# EAGLE design Mergen Ground Station_V2.0 (EAGLE 9.6.2)

## Sheet 1 of 5
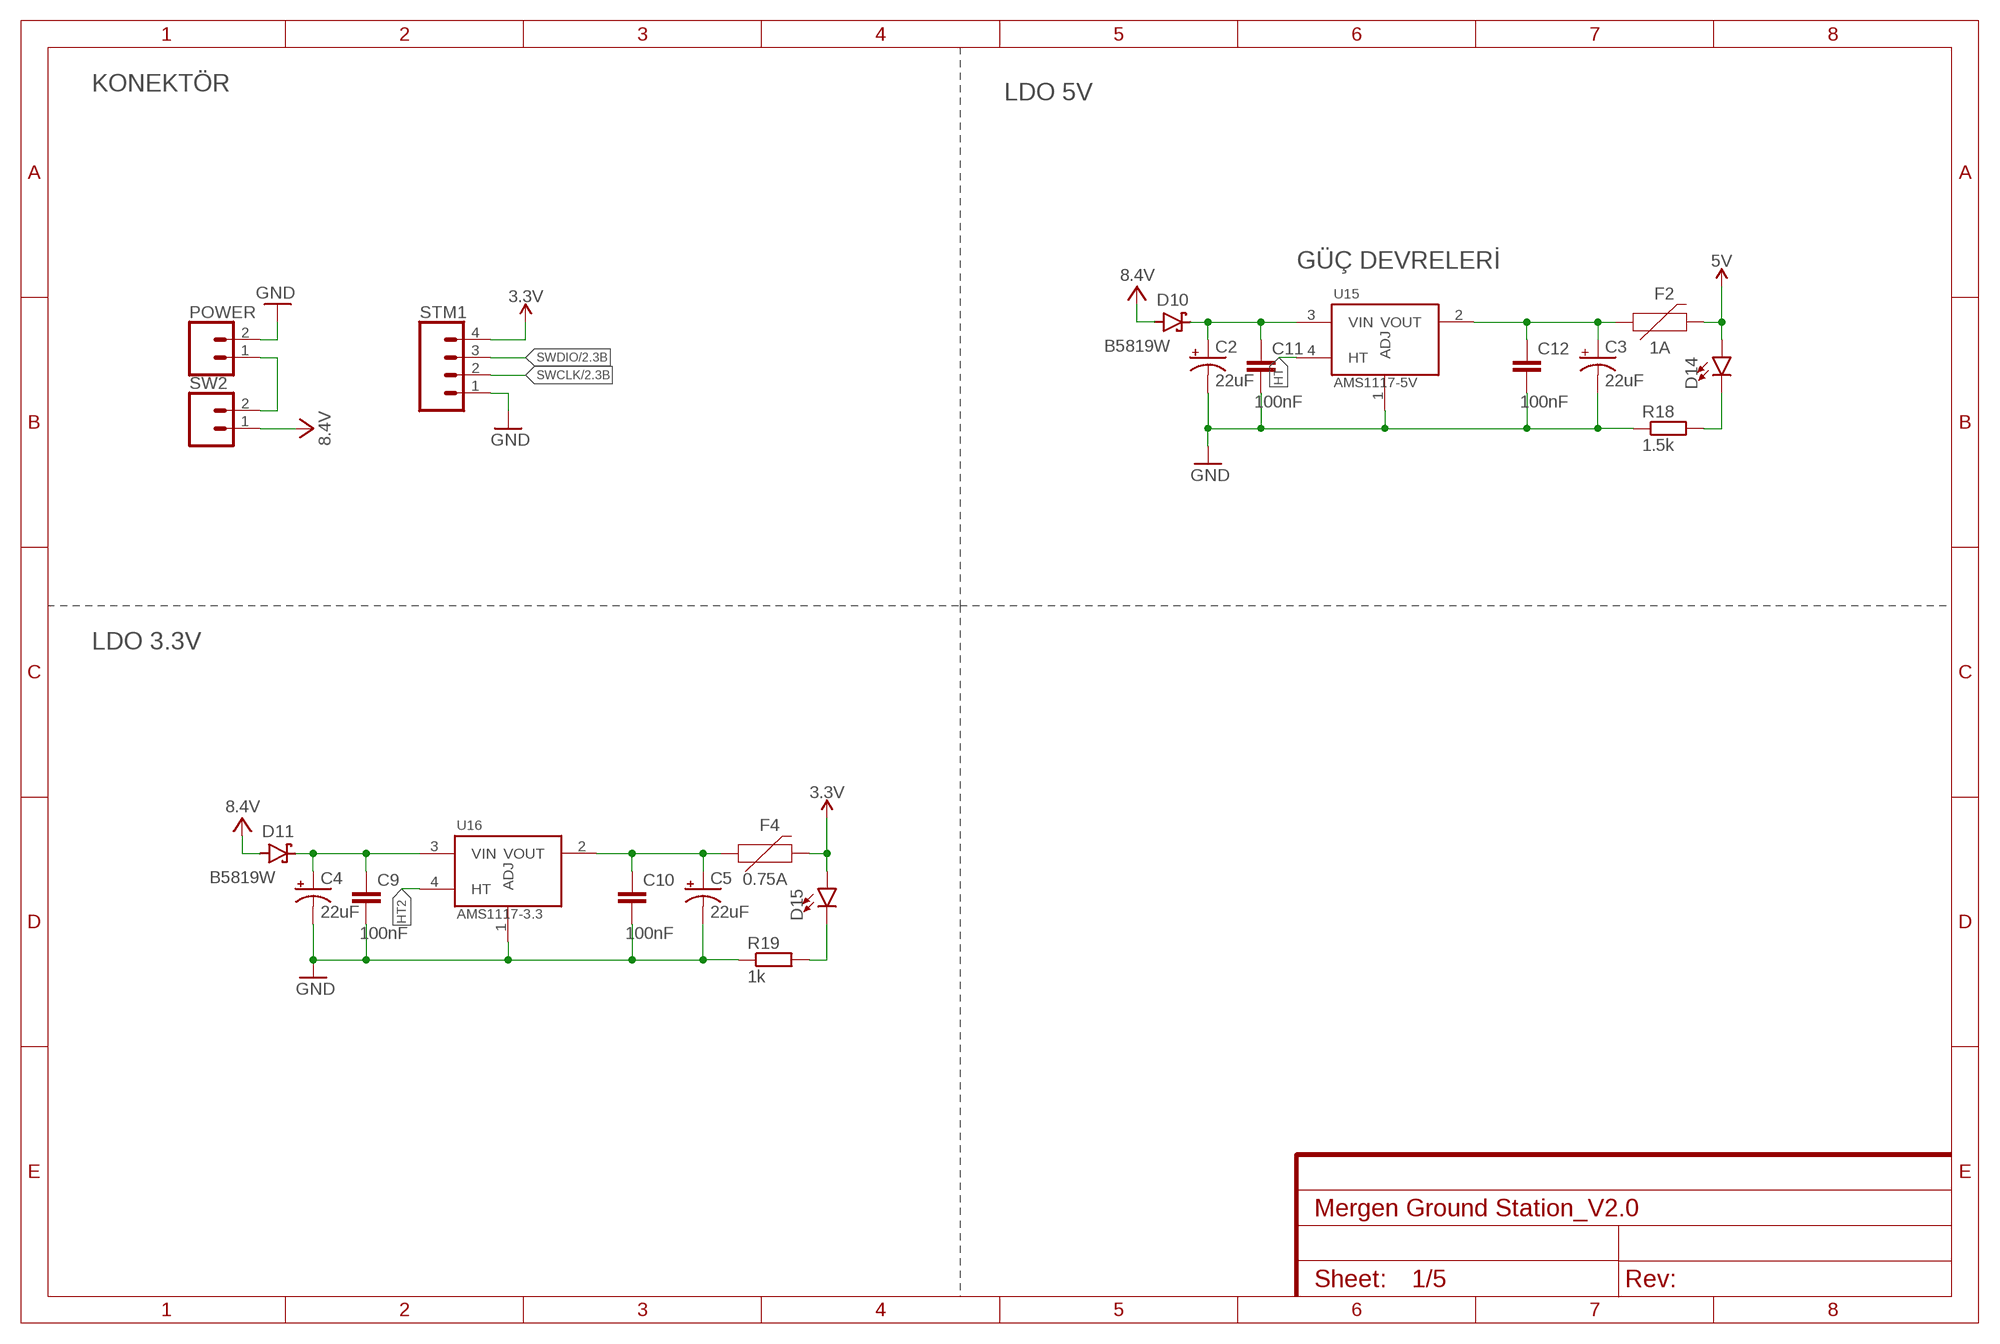
[diagram p0: schematic, sheet 1]

### Parts
C2  22uF  CPOL-USCT3528  [CT3528]
C3  22uF  CPOL-USCT3528  [CT3528]
C4  22uF  CPOL-USCT3528  [CT3528]
C5  22uF  CPOL-USCT3528  [CT3528]
C9  100nF  C-EUC0603  [C0603]
C10  100nF  C-EUC0603  [C0603]
C11  100nF  C-EUC0603  [C0603]
C12  100nF  C-EUC0603  [C0603]
D10  B5819W  SCHOTTKY_MBR0520LT1GDO-219  [SODFL3718X115]
D11  B5819W  SCHOTTKY_MBR0520LT1GDO-219  [SODFL3718X115]
D14  LED0603  [LED-0603]
D15  LED0603  [LED-0603]
F2  1A  PPTC_HALF-AMP  [1206]
F4  0.75A  PPTC_HALF-AMP  [1206]
POWER  CONN_023.5MM-NO_SILK  [SCREWTERMINAL-3.5MM-2-NS]
R18  1.5k  R-EU_R0603  [R0603]
R19  1k  R-EU_R0603  [R0603]
STM1  CONN_04  [1X04]
SW2  CONN_023.5MM-NO_SILK  [SCREWTERMINAL-3.5MM-2-NS]
U15  AMS1117-5V  AMS1117-3.3  [SOT229P700X180-4N]
U16  AMS1117-3.3  [SOT229P700X180-4N]

### Nets
3.3V: D15.A F4.2 STM1.4 ; also sheet 2,3,5
5V: D14.A F2.2 ; also sheet 4,5
GND: C2.- C3.- C4.- C5.- C9.2 C10.2 C11.2 C12.2 POWER.2 R18.1 R19.1 STM1.1 U15.1(ADJ) U16.1(ADJ) ; also sheet 2,3,4,5
HT: U15.4(HT)
HT2: U16.4(HT)
N$22: C2.+ C11.1 D10.1(C) U15.3(VIN)
N$23: C3.+ C12.1 F2.1 U15.2(VOUT)
N$24: C4.+ C9.1 D11.1(C) U16.3(VIN)
N$25: C5.+ C10.1 F4.1 U16.2(VOUT)
N$30: POWER.1 SW2.2
N$35: D14.C R18.2
N$36: D15.C R19.2
SWCLK: STM1.2 ; also sheet 2
SWDIO: STM1.3 ; also sheet 2
VCC: D10.2(A) D11.2(A) SW2.1 ; supply symbol labelled 8.4V ; also sheet 2

### Notes on the sheet
- KONEKTÖR
- LDO 5V
- GÜÇ DEVRELERİ
- LDO 3.3V

## Sheet 2 of 5
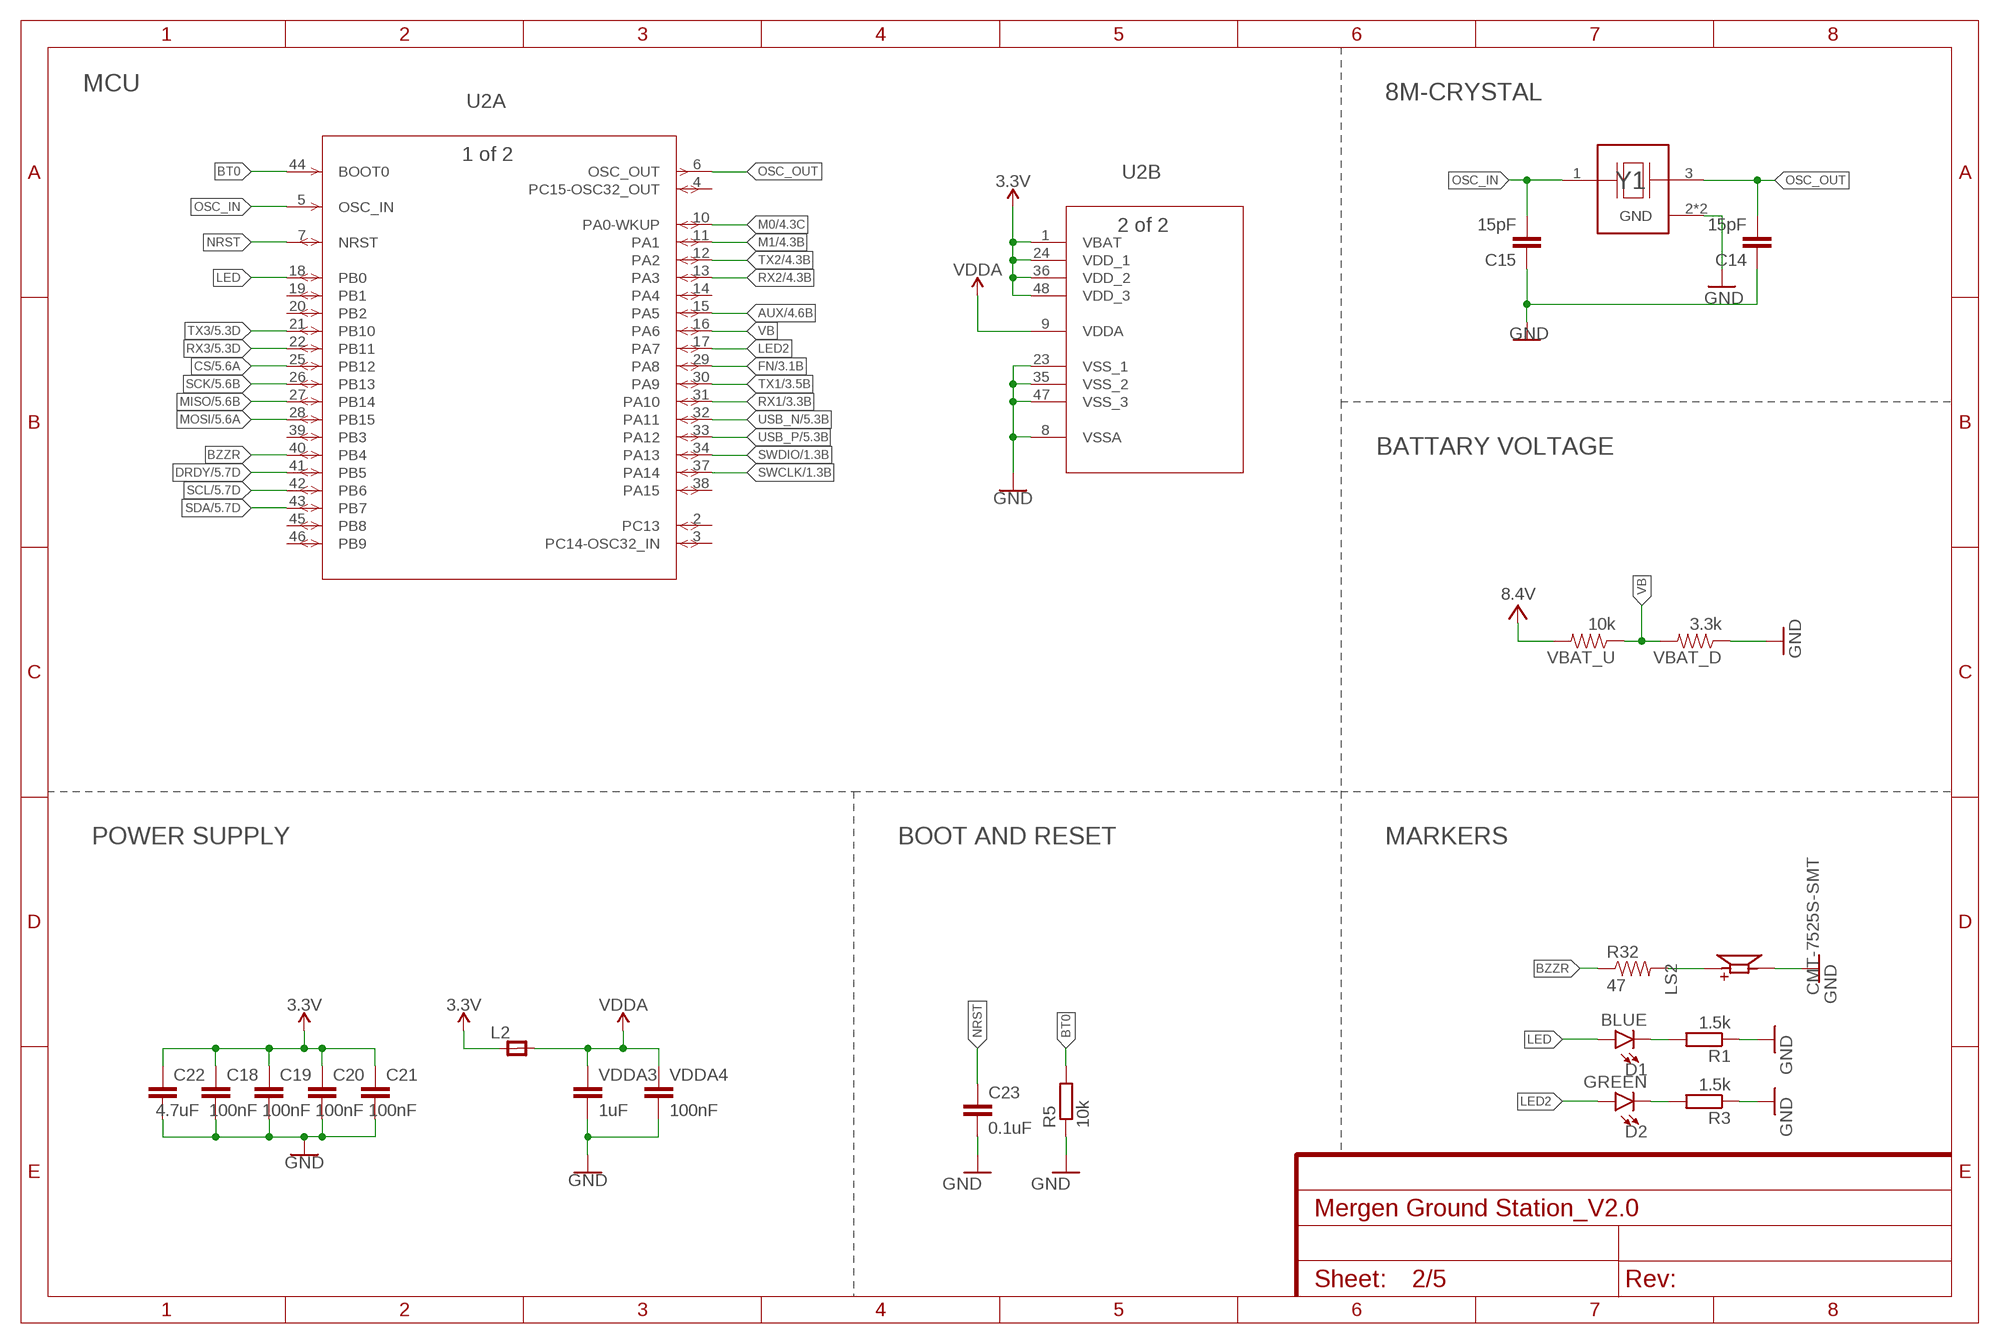
[diagram p1: schematic, sheet 2]

### Parts
C14  15pF  C-EUC0603  [C0603]
C15  15pF  C-EUC0603  [C0603]
C18  100nF  C-EUC0603  [C0603]
C19  100nF  C-EUC0603  [C0603]
C20  100nF  C-EUC0603  [C0603]
C21  100nF  C-EUC0603  [C0603]
C22  4.7uF  C-EUC0603  [C0603]
C23  0.1uF  C-EUC0603  [C0603]
D1  BLUE  LED0603  [LED-0603]
D2  GREEN  LED0603  [LED-0603]
L2  RC-MASTER-SMD_FB_0805MP  [RC-MASTER-SMD_L0805MP]
LS2  CMT-7525S-SMT  [CUI_CMT-7525S-SMT]
R1  1.5k  R-EU_R0603  [R0603]
R3  1.5k  R-EU_R0603  [R0603]
R5  10k  R-EU_R0603  [R0603]
R32  47  0OHM-0603-1/10W-5%  [0603]
U2  STM32F103C8T6  [LQFP48-7X7MM]
VBAT_D  3.3k  2.0KOHM1/10W5%(0603)  [0603-RES]
VBAT_U  10k  2.0KOHM1/10W5%(0603)  [0603-RES]
VDDA3  1uF  0.1UF-0603-25V-(+80/-20%)  [0603]
VDDA4  100nF  0.1UF-0603-25V-(+80/-20%)  [0603]
Y1  ABMM2-8.000MHZ-E2-T  [XTAL_ABMM2-8.000MHZ-E2-T]

### Nets
3.3V: C18.1 C19.1 C20.1 C21.1 C22.1 L2.1 U2.1(B:VBAT) U2.24(B:VDD_1) U2.36(B:VDD_2) U2.48(B:VDD_3) ; also sheet 1,3,5
AUX: U2.15(A:PA5) ; also sheet 4
BT0: R5.2 U2.44(A:BOOT0)
BZZR: R32.1 U2.40(A:PB4)
CS: U2.25(A:PB12) ; also sheet 5
DRDY: U2.41(A:PB5) ; also sheet 5
FN: U2.29(A:PA8) ; also sheet 3
GND: C14.1 C15.1 C18.2 C19.2 C20.2 C21.2 C22.2 C23.2 LS2.N R1.1 R3.1 R5.1 U2.8(B:VSSA) U2.23(B:VSS_1) U2.35(B:VSS_2) U2.47(B:VSS_3) VBAT_D.1 VDDA3.2 VDDA4.2 Y1.2(GND) Y1.4(GND) ; also sheet 1,3,4,5
LED: D1.A U2.18(A:PB0)
LED2: D2.A U2.17(A:PA7)
M0: U2.10(A:PA0-WKUP) ; also sheet 4
M1: U2.11(A:PA1) ; also sheet 4
MISO: U2.27(A:PB14) ; also sheet 5
MOSI: U2.28(A:PB15) ; also sheet 5
N$1: D1.C R1.2
N$3: D2.C R3.2
N$4: LS2.P R32.2
NRST: C23.1 U2.7(A:NRST)
OSC_IN: C15.2 U2.5(A:OSC_IN) Y1.1
OSC_OUT: C14.2 U2.6(A:OSC_OUT) Y1.3
RX1: U2.31(A:PA10) ; also sheet 3
RX2: U2.13(A:PA3) ; also sheet 4
RX3: U2.22(A:PB11) ; also sheet 5
SCK: U2.26(A:PB13) ; also sheet 5
SCL: U2.42(A:PB6) ; also sheet 5
SDA: U2.43(A:PB7) ; also sheet 5
SWCLK: U2.37(A:PA14) ; also sheet 1
SWDIO: U2.34(A:PA13) ; also sheet 1
TX1: U2.30(A:PA9) ; also sheet 3
TX2: U2.12(A:PA2) ; also sheet 4
TX3: U2.21(A:PB10) ; also sheet 5
USB_N: U2.32(A:PA11) ; also sheet 5
USB_P: U2.33(A:PA12) ; also sheet 5
VB: U2.16(A:PA6) VBAT_D.2 VBAT_U.1
VCC: VBAT_U.2 ; supply symbol labelled 8.4V ; also sheet 1
VDDA: L2.2 U2.9(B:VDDA) VDDA3.1 VDDA4.1
Unconnected: U2.2(A:PC13) U2.3(A:PC14-OSC32_IN) U2.4(A:PC15-OSC32_OUT) U2.14(A:PA4) U2.19(A:PB1) U2.20(A:PB2) U2.38(A:PA15) U2.39(A:PB3) U2.45(A:PB8) U2.46(A:PB9)

### Notes on the sheet
- MCU
- 8M-CRYSTAL
- BATTARY VOLTAGE
- POWER SUPPLY | BOOT AND RESET | MARKERS

## Sheet 3 of 5
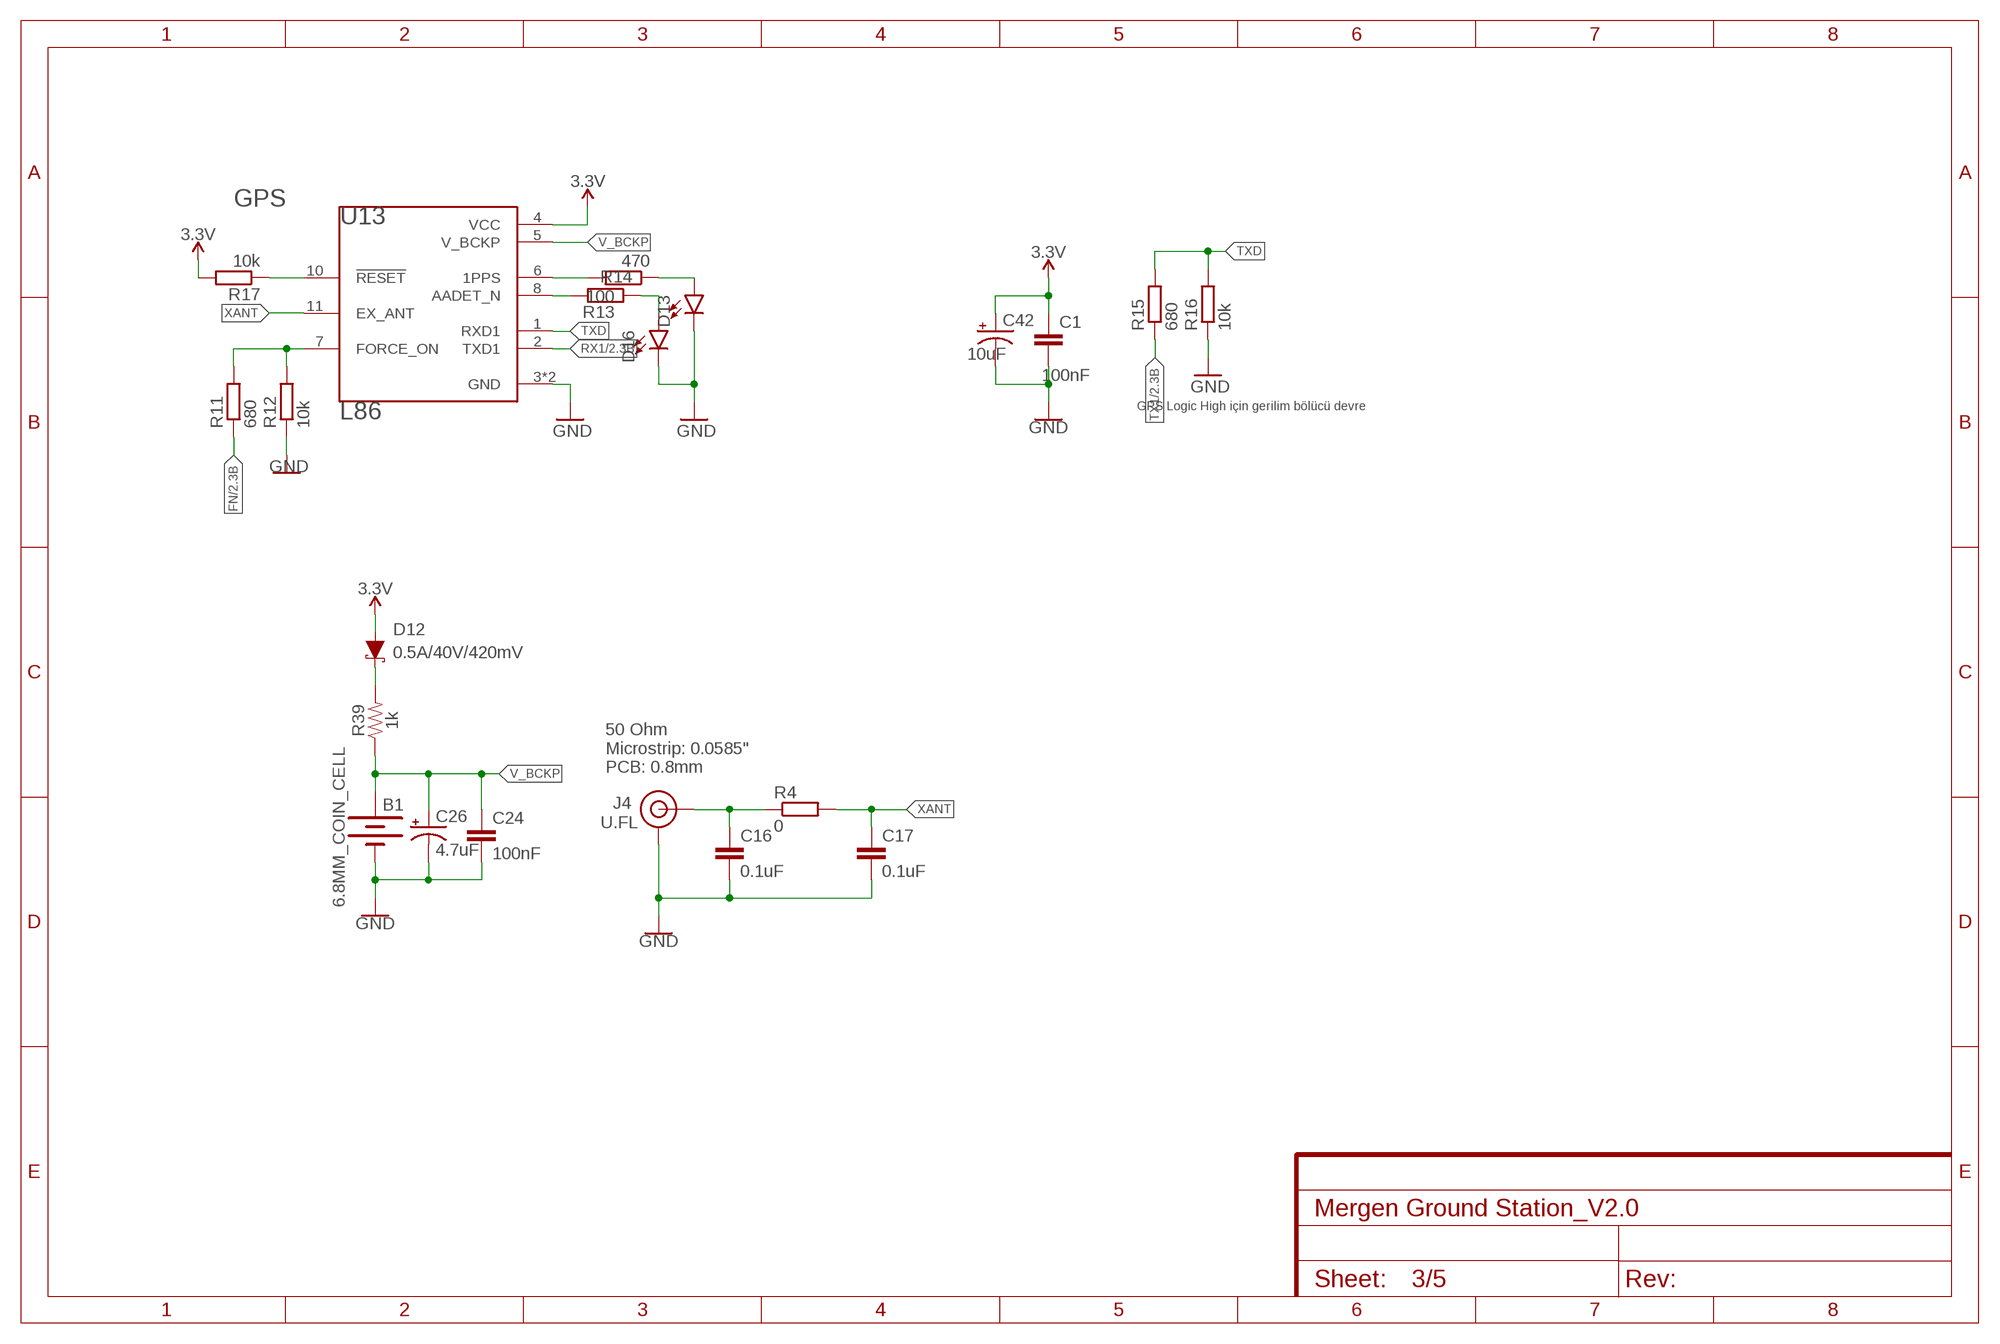
[diagram p2: schematic, sheet 3]

### Parts
B1  6.8MM_COIN_CELL  BATTERY-6.8MM_SMD  [BATTCON-6.8MM]
C1  100nF  C-EUC0603  [C0603]
C16  0.1uF  C-EUC0603  [C0603]
C17  0.1uF  C-EUC0603  [C0603]
C24  100nF  C-EUC0603  [C0603]
C26  4.7uF  CPOL-USA/3216-18R  [A/3216-18R]
C42  10uF  10UF-POLAR-EIA3216-16V-10%(TANT)  [EIA3216]
D12  0.5A/40V/420mV  DIODE-SCHOTTKY-PMEG4005EJ  [SOD-323]
D13  LED0603  [LED-0603]
D16  LED0603  [LED-0603]
J4  U.FL  U.FL2PIN  [U.FL]
R4  0  R-EU_R0603  [R0603]
R11  680  R-EU_R0603  [R0603]
R12  10k  R-EU_R0603  [R0603]
R13  100  R-EU_R0603  [R0603]
R14  470  R-EU_R0603  [R0603]
R15  680  R-EU_R0603  [R0603]
R16  10k  R-EU_R0603  [R0603]
R17  10k  R-EU_R0603  [R0603]
R39  1k  1KOHM-0603-1/10W-1%  [0603]
U13  L86  [XCVR_L86]

### Nets
3.3V: C1.1 C42.+ D12.A R17.2 U13.4(VCC) ; also sheet 1,2,5
FN: R11.1 ; also sheet 2
GND: B1.- C1.2 C16.2 C17.2 C24.2 C26.- C42.- D13.C D16.C J4.1(GND) J4.2(GND) R12.1 R16.1 U13.3(GND) U13.12(GND) ; also sheet 1,2,4,5
N$2: D16.A R13.1
N$31: D12.C R39.2
N$32: R17.1 U13.10(!RESET)
N$33: R14.2 U13.6(1PPS)
N$34: D13.A R14.1
N$37: R13.2 U13.8(AADET_N)
N$39: C16.1 J4.FEED(SIGNAL) R4.1
N$40: R11.2 R12.2 U13.7(FORCE_ON)
RX1: U13.2(TXD1) ; also sheet 2
TX1: R15.1 ; also sheet 2
TXD: R15.2 R16.2 U13.1(RXD1)
V_BCKP: B1.+ C24.1 C26.+ R39.1 U13.5(V_BCKP)
XANT: C17.1 R4.2 U13.11(EX_ANT)

### Notes on the sheet
- GPS
- GPS Logic High için gerilim bölücü devre
- 50 Ohm 
  Microstrip: 0.0585"
  PCB: 0.8mm

## Sheet 4 of 5
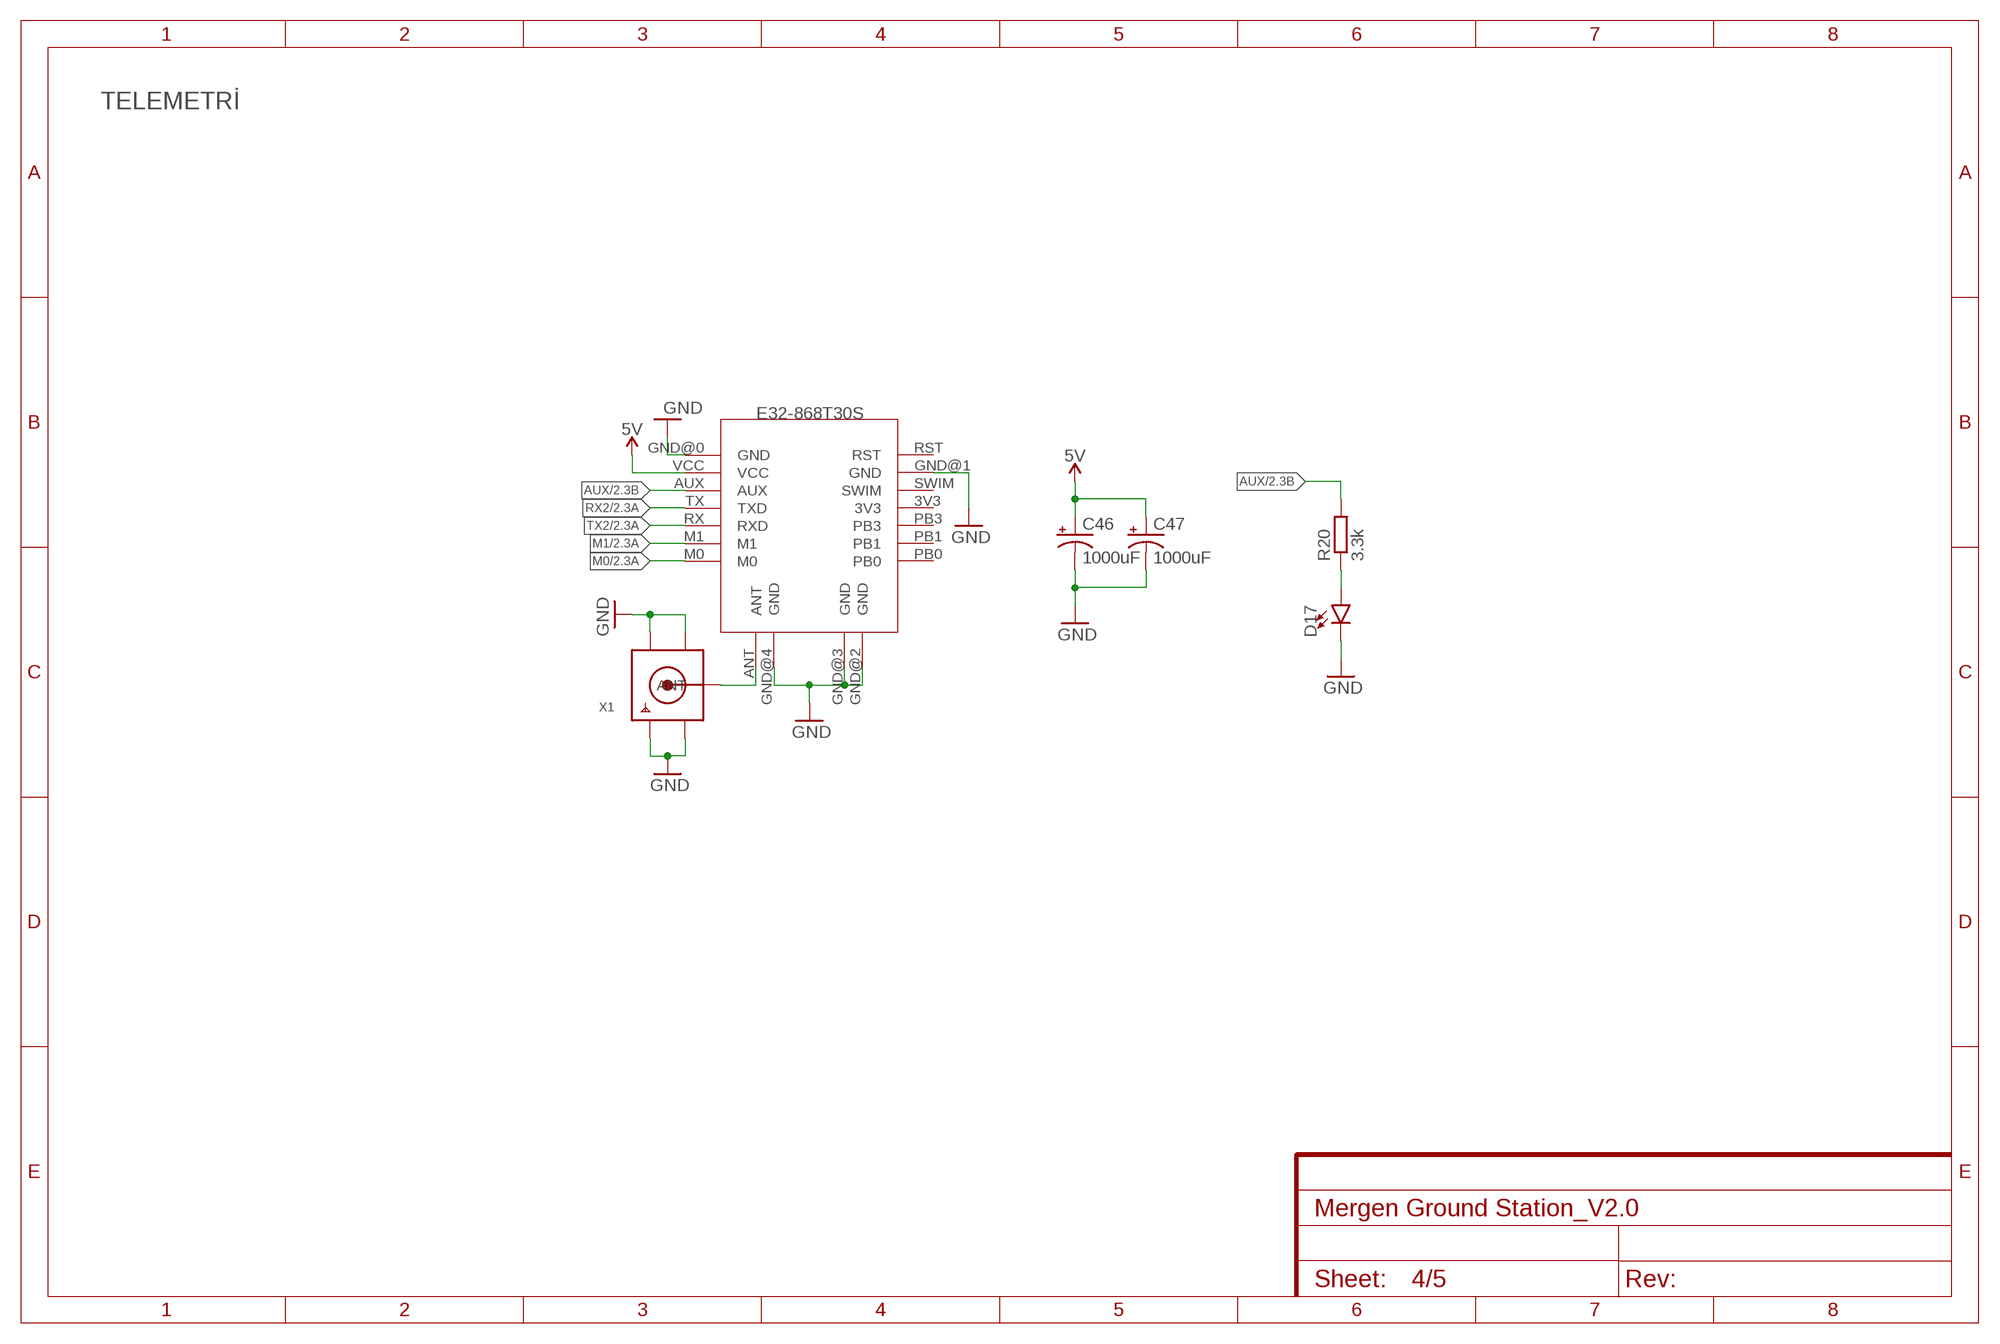
[diagram p3: schematic, sheet 4]

### Parts
C46  1000uF  CPOL-US150CLZ-1010  [150CLZ-1010]
C47  1000uF  CPOL-US150CLZ-1010  [150CLZ-1010]
D17  LED0603  [LED-0603]
R20  3.3k  R-EU_R0603  [R0603]
U14  E32-868T30S  [E32-868T30S]
X1  SMACONNECTOR  [SMA90_DIP]

### Nets
5V: C46.+ C47.+ U14.VCC ; also sheet 1,5
AUX: R20.2 U14.AUX ; also sheet 2
GND: C46.- C47.- D17.C U14.GND@0(GND) U14.GND@1(GND) U14.GND@2(GND) U14.GND@3(GND) U14.GND@4(GND) X1.GND1 X1.GND2 X1.GND3 X1.GND4 ; also sheet 1,2,3,5
M0: U14.M0 ; also sheet 2
M1: U14.M1 ; also sheet 2
N$27: U14.ANT X1.ANTENNA(ANT)
N$41: D17.A R20.1
RX2: U14.TX(TXD) ; also sheet 2
TX2: U14.RX(RXD) ; also sheet 2
Unconnected: U14.3V3 U14.PB0 U14.PB1 U14.PB3 U14.RST U14.SWIM

### Notes on the sheet
- TELEMETRİ

## Sheet 5 of 5
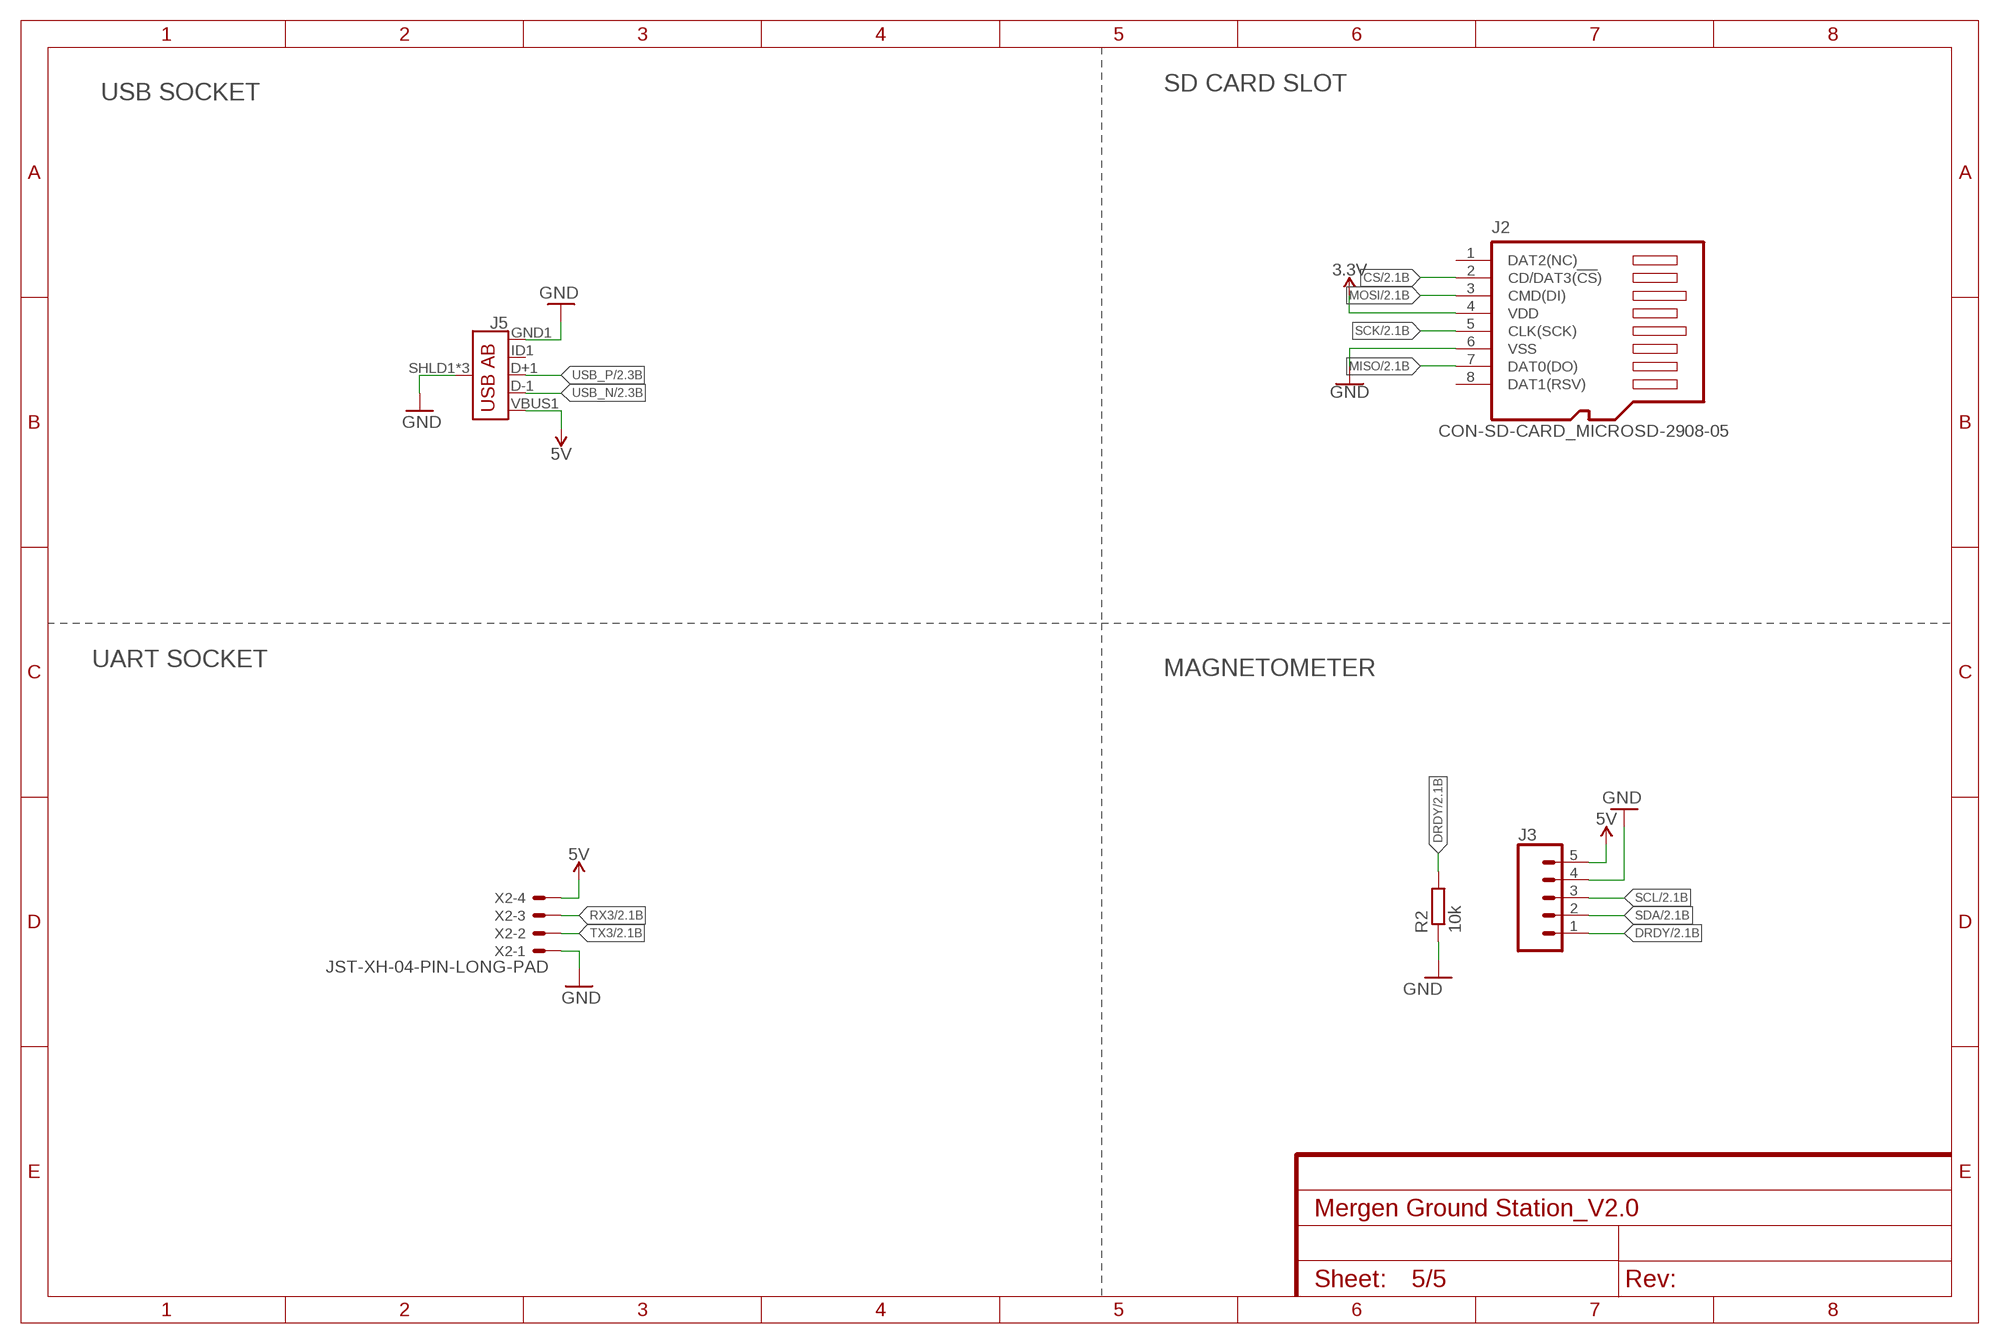
[diagram p4: schematic, sheet 5]

### Parts
J2  CON-SD-CARD_MICROSD-2908-05  [CON-SD-CARD_2908-05]
J3  CONN_05LOCK_LONGPADS  [1X05_LOCK_LONGPADS]
J5  USB_AB_SMT  [USB-AB-MICRO-SMD]
R2  10k  R-EU_R0603  [R0603]
X2  JST-XH-04-PIN-LONG-PAD  [JST-XH-04-PACKAGE-LONG-PAD]

### Nets
3.3V: J2.4(VDD) ; also sheet 1,2,3
5V: J3.5 J5.VBUS1(VBUS) X2.4 ; also sheet 1,4
CS: J2.2(CD/DAT3(!CS!)) ; also sheet 2
DRDY: J3.1 R2.2 ; also sheet 2
GND: J2.6(VSS) J3.4 J5.GND1(GND) J5.SHLD1(SHIELD) J5.SHLD2(SHIELD) J5.SHLD3(SHIELD) R2.1 X2.1 ; also sheet 1,2,3,4
MISO: J2.7(DAT0(DO)) ; also sheet 2
MOSI: J2.3(CMD(DI)) ; also sheet 2
RX3: X2.3 ; also sheet 2
SCK: J2.5(CLK(SCK)) ; also sheet 2
SCL: J3.3 ; also sheet 2
SDA: J3.2 ; also sheet 2
TX3: X2.2 ; also sheet 2
USB_N: J5.D-1(D-) ; also sheet 2
USB_P: J5.D+1(D+) ; also sheet 2
Unconnected: J2.1(DAT2(NC)) J2.8(DAT1(RSV)) J2.GND@1(GND) J2.GND@2(GND) J2.GND@3(GND) J2.GND@4(GND) J5.ID1(USBID)

### Notes on the sheet
- SD CARD SLOT
- USB SOCKET
- UART SOCKET
- MAGNETOMETER

## Library data of the parts
B1 = SparkFun-Batteries:BATTERY: Battery - Single Cell A variety of battery chemistries, sizes, and footprints. Device List: 20MM_PTH - Coin Cell Battery Holder - 20mm (PTH) <https://www.sparkfun.com/products/783> 6.8MM_PTH - Coin Cell Battery Holder - 6.8MM(SMD) <https://www.digikey.com/product-detail/en/seiko-instruments/MS621FE-FL11E/728-1057-ND/1889208?WT.srch=1&gclid=CNOQ5a6LzdQCFZS2wAodXCkE0g> 12MM_SMD - Coin Cell Battery Holder - 12mm (SMD) <https://www.sparkfun.com/products/10592> 12MM_PTH - Coin Cell Battery Holder - 12mm (PTH) <https://www.sparkfun.com/products/7948> 20MM_SMD - 20mm Coin Cell Battery Holder (SMD) (2 legs) Used on the Big Time Watch Kit <https://www.sparkfun.com/products/11734> 20MM_SMD_4LEGS - Coin Cell Battery Holder - 20mm (SMD) <https://www.sparkfun.com/products/11892> 20MM_SMD_4LEGS_OVERPASTE - Coin Cell Battery Holder - 20mm (SMD) <https://www.sparkfun.com/products/11892> (Over-paste on the legs) 24.5MM_PTH - Coin Cell Battery Holder - 24.5mm (PTH) <https://www.sparkfun.com/products/8863> 9V - 9V Battery Holder - PC Mount Used on the SparkFun SparkPunk Sound Kit <https://www.sparkfun.com/products/11177> and SparkFun SparkPunk Sequencer Kit <https://www.sparkfun.com/products/12707> 18650 - Battery Holder - 18650 (PTH) <https://www.sparkfun.com/products/13113> AA - Battery Holder - 1xAA (PTH) <https://www.sparkfun.com/products/7949> AAA - Battery Holder - 1xAAA (PTH) <https://www.sparkfun.com/products/12718> AA_KIT - Battery Holder - 1xAA (PTH) <https://www.sparkfun.com/products/7949> Special kit package - pads only have exposed copper on one side of the board. AAA_KIT - Battery Holder - 1xAAA (PTH) <https://www.sparkfun.com/products/12718> Special kit package - pads only have exposed copper on one side of the board.; PROD_ID: BATT-13734
C1 C9-C12 C14-C24 = rcl:C-EU: CAPACITOR, European symbol; SPICEPREFIX: C
C2-C5 C26 = rcl:CPOL-US: POLARIZED CAPACITOR, American symbol; SPICEPREFIX: C
C42 = SparkFun-Capacitors:10UF-POLAR: 10.0µF polarized capacitors A capacitor is a passive two-terminal electrical component used to store electrical energy temporarily in an electric field.; PROD_ID: CAP-00811
C46 C47 = adafruit:CPOL-US: POLARIZED CAPACITOR, American symbol
D1 D2 D13-D17 = SparkFun-LED:LED: LED (Generic) Standard schematic elements and footprints for 5mm, 3mm, 1206, and 0603 sized LEDs. Generic LEDs with no color specified.
D10 D11 = Diode:SCHOTTKY_: Schottky Diode - Popular parts; CATEGORY: Diode; DESCRIPTION: DIODE SCHOTTKY 20V 500MA SOD123; MANUFACTURER: ON Semiconductor; MPN: MBR0520LT1G; SUB-CATEGORY: Schottky; VALUE: MBR0520LT1G
D12 = SparkFun-DiscreteSemi:DIODE-SCHOTTKY: Schottky diode A Schottky diode is a semiconductor diode which has a low forward voltage drop and a very fast switching action.; PROD_ID: DIO-10955
F2 F4 = SparkFun-Fuses:PPTC: Resettable Fuse PPTC Resettable Fuse. Really a sort of resistor with a polymeric positive temperature coefficient whose resistance increases dramatically with an increase in temperature. When heated by the power passing through the resistance rises causing the current to be limited, protecting the circuit. This is achieved by the transition of the polymer from a crystalline to an amorphous state where the conductive carbon separates breaking the conductive pathways found in the cool crystalline structure. When a PPTC cools back down it resumes conducting letting the circuit turn back on. SparkFun Products: SparkFun RedBoard - Programmed with Arduino <https://www.sparkfun.com/products/12757> Pro Micro - 5V/16MHz <https://www.sparkfun.com/products/12640> Arduino Pro 328 - 5V/16MHz <https://www.sparkfun.com/products/10915> MP3 Trigger <https://www.sparkfun.com/products/13720>; PROD_ID: RES-08585; VALUE: 6V/0.5A
J2 = 52101-101-REV-A_v16:CON-SD-CARD_MICROSD-: microSD Connector
J3 = SparkFun-Connectors:CONN_05: Multi connection point. Often used as Generic Header-pin footprint for 0.1 inch spaced/style header connections On any of the 0.1 inch spaced packages, you can populate with these: Break Away Headers - Straight <https://www.sparkfun.com/products/116> (PRT-00116) Break Away Male Headers - Right Angle <https://www.sparkfun.com/products/553> (PRT-00553) Female Headers <https://www.sparkfun.com/products/115> (PRT-00115) Break Away Headers - Machine Pin <https://www.sparkfun.com/products/117> (PRT-00117) Break Away Female Headers - Swiss Machine Pin <https://www.sparkfun.com/products/743> (PRT-00743) For SCREWTERMINALS and SPRING TERMINALS visit here: Screw Terimnals on SparkFun.com <https://www.sparkfun.com/search/results?term=Screw+Terminals> (5mm/3.5mm/2.54mm spacing) This device is also useful as a general connection point to wire up your design to another part of your project. Our various solder wires solder well into these plated through hole pads. Hook-Up Wire - Assortment (Stranded, 22 AWG) <https://www.sparkfun.com/products/11375> (PRT-11375) Hook-Up Wire - Assortment (Solid Core, 22 AWG) <https://www.sparkfun.com/products/11367> (PRT-11367) View the entire wire category on our website here <https://www.sparkfun.com/categories/141> Special notes: Molex polarized connector foot print use with SKU : PRT-08231 with associated crimp pins and housings. 1MM SMD Version SKU: PRT-10208
J4 = SparkFun-Connectors:U.FL2PIN: SMD Antenna Connector - U.FL 2mm height, 3.0mm x 3.0mm receptacle size. SparkFun Products: SparkFun WiFi Shield - ESP8266 <https://www.sparkfun.com/products/13287> SparkFun ESP8266 Thing <https://www.sparkfun.com/products/13231> SparkFun MiniGen - Pro Mini Signal Generator Shield <https://www.sparkfun.com/products/11420>; PROD_ID: CONN-09193; SF_ID: WRL-09144
J5 = SparkFun-Connectors:USB_AB: USB Type AB Micro Connector OTG-compatible. 5 pins, 3 shield pins SparkFun Products: IOIO-OTG <https://www.sparkfun.com/products/13613> SparkFun SAMD21 Mini Breakout <https://www.sparkfun.com/products/13664>; PROD_ID: CONN-11794
L2 = 52101-101-REV-A_v16:RC-MASTER-SMD_FB_: FERRITE BEAD
LS2 = CMT-7525S-SMT:CMT-7525S-SMT: 7.5 mm, 3.6 Vo-p, 90 dB, Surface Mount (SMT), Magnetic Audio Transducer Buzzer Check prices <https://pricing.snapeda.com/parts/CMT-7525S-SMT-TR/CUI%20Devices/view-part?ref=eda>; AVAILABILITY: In Stock; CUI_PURCHASE_URL: https://www.cuidevices.com/product/audio/buzzers/audio-transducers/cmt-7525s-smt-tr?utm_source=snapeda.com&utm_medium=referral&utm_campaign=snapedaBOM; DESCRIPTION: 7.5 mm, 3.6 Vo-p, 90 dB, Surface Mount (SMT), Magnetic Audio Transducer Buzzer; MF: CUI Devices; MP: CMT-7525S-SMT-TR; PACKAGE: CUI Inc.; PRICE: None
POWER SW2 = SparkFun-Connectors:CONN_02: Multi connection point. Often used as Generic Header-pin footprint for 0.1 inch spaced/style header connections On any of the 0.1 inch spaced packages, you can populate with these: Break Away Headers - Straight <https://www.sparkfun.com/products/116> (PRT-00116) Break Away Male Headers - Right Angle <https://www.sparkfun.com/products/553> (PRT-00553) Female Headers <https://www.sparkfun.com/products/115> (PRT-00115) Break Away Headers - Machine Pin <https://www.sparkfun.com/products/117> (PRT-00117) Break Away Female Headers - Swiss Machine Pin <https://www.sparkfun.com/products/743> (PRT-00743) For SCREWTERMINALS and SPRING TERMINALS visit here: Screw Terimnals on SparkFun.com <https://www.sparkfun.com/search/results?term=Screw+Terminals> (5mm/3.5mm/2.54mm spacing) This device is also useful as a general connection point to wire up your design to another part of your project. Our various solder wires solder well into these plated through hole pads. Hook-Up Wire - Assortment (Stranded, 22 AWG) <https://www.sparkfun.com/products/11375> (PRT-11375) Hook-Up Wire - Assortment (Solid Core, 22 AWG) <https://www.sparkfun.com/products/11367> (PRT-11367) View the entire wire category on our website here <https://www.sparkfun.com/categories/141> Special notes: Molex polarized connector foot print use with: PRT-08233 with associated crimp pins and housings. 2.54_SCREWTERM for use with PRT-10571. 3.5mm Screw Terminal footprints for PRT-08084 5mm Screw Terminal footprints for use with PRT-08432; PROD_ID: CONN-08399
R1-R5 R11-R20 = rcl:R-EU_: RESISTOR, European symbol; SPICEPREFIX: R
R32 = SparkFun-Resistors:0OHM: 0Ω resistor A resistor is a passive two-terminal electrical component that implements electrical resistance as a circuit element. Resistors act to reduce current flow, and, at the same time, act to lower voltage levels within circuits. - Wikipedia; PROD_ID: RES-08609; VALUE: 0
R39 = SparkFun-Resistors:1KOHM: 1kΩ resistor A resistor is a passive two-terminal electrical component that implements electrical resistance as a circuit element. Resistors act to reduce current flow, and, at the same time, act to lower voltage levels within circuits. - Wikipedia; PROD_ID: RES-07856
STM1 = SparkFun-Connectors:CONN_04: Multi connection point. Often used as Generic Header-pin footprint for 0.1 inch spaced/style header connections On any of the 0.1 inch spaced packages, you can populate with these: Break Away Headers - Straight <https://www.sparkfun.com/products/116> (PRT-00116) Break Away Male Headers - Right Angle <https://www.sparkfun.com/products/553> (PRT-00553) Female Headers <https://www.sparkfun.com/products/115> (PRT-00115) Break Away Headers - Machine Pin <https://www.sparkfun.com/products/117> (PRT-00117) Break Away Female Headers - Swiss Machine Pin <https://www.sparkfun.com/products/743> (PRT-00743) For SCREWTERMINALS and SPRING TERMINALS visit here: Screw Terimnals on SparkFun.com <https://www.sparkfun.com/search/results?term=Screw+Terminals> (5mm/3.5mm/2.54mm spacing) This device is also useful as a general connection point to wire up your design to another part of your project. Our various solder wires solder well into these plated through hole pads. Hook-Up Wire - Assortment (Stranded, 22 AWG) <https://www.sparkfun.com/products/11375> (PRT-11375) Hook-Up Wire - Assortment (Solid Core, 22 AWG) <https://www.sparkfun.com/products/11367> (PRT-11367) View the entire wire category on our website here <https://www.sparkfun.com/categories/141> Special notes: Molex polarized connector foot print use with SKU : PRT-08231 with associated crimp pins and housings. 1MM SMD Version SKU: PRT-10208; PROD_ID: CONN-09696
U2 = STM32F103C8T6:STM32F103C8T6; BUILT_BY: EMA_UL_Team; COPYRIGHT: Copyright (C) 2018 Accelerated Designs. All rights reserved; MANUFACTURER_PART_NUMBER: STM32F103C8T6; SOURCELIBRARY: Updates_to_database_2020-10-19; VENDOR: STMicroelectronics
U13 = L86:L86: L86 is an ultra-compact GNSS POT (Patch on Top) module with an embedded 18.4mm × 18.4mm × 4.0mm patch antenna and utilizes the MediaTek new generation GNSS chipset MT3333 that achieves the perfect performance; AVAILABILITY: Unavailable; DESCRIPTION: L86 is an ultra-compact GNSS POT (Patch on Top) module with an embedded 18.4mm × 18.4mm × 4.0mm patch antenna and utilizes the MediaTek new generation GNSS chipset MT3333 that achieves the perfect performance; MF: Quectel; MP: L86; PACKAGE: PowerSFN-8 Quectel; PRICE: None
U14 = E32-868T30S:E32-868T30S: E BYTE E32-868T30S
U15 U16 = AMS1117-3.3:AMS1117-3.3: Sot223/Pkg 1-Amp 3.3-Volt Low Drop Out Voltage Regulatator; AVAILABILITY: Unavailable; DESCRIPTION: Sot223/Pkg 1-Amp 3.3-Volt Low Drop Out Voltage Regulatator; MF: Advanced Monolithic Systems; MP: AMS1117-3.3; PACKAGE: SOT-89 ams; PRICE: None
VBAT_D VBAT_U = SparkFun-Resistors:2.0KOHM1/10W5%(0603): RES-08296; PROD_ID: RES-08296; VALUE: 2.0k
VDDA3 VDDA4 = SparkFun-Capacitors:0.1UF: 0.1µF ceramic capacitors A capacitor is a passive two-terminal electrical component used to store electrical energy temporarily in an electric field.; PROD_ID: CAP-00810; VALUE: 0.1uF
X1 = adafruit:SMACONNECTOR: SMA Connector 90° DIP SMA Connector, 50 Ohm (4UConnector: 07259)
X2 = Rembrandt Electronics - JST XH Connectors v1-0:JST-XH-04-PIN: JST XH Connector 2 Pin Wire to board connector. Pitch: 2,54 mm, (0.100") Number of pins: 4 Created by Rembrandt Electronics www.rembrandtelectronics.com
Y1 = ABMM2-8.000MHZ-E2-T (1):ABMM2-8.000MHZ-E2-T: Check prices <https://pricing.snapeda.com/parts/ABMM2-8.000MHZ-E2-T/Abracon/view-part?ref=eda>; AVAILABILITY: Good; DESCRIPTION: 8MHz ±20ppm Crystal 18pF 72 Ohms 4-SMD, No Lead; MF: Abracon; MP: ABMM2-8.000MHZ-E2-T; PACKAGE: SMD-4 Abracon; PRICE: None; PURCHASE-URL: https://pricing.snapeda.com/search/part/ABMM2-8.000MHZ-E2-T/?ref=eda

## Board
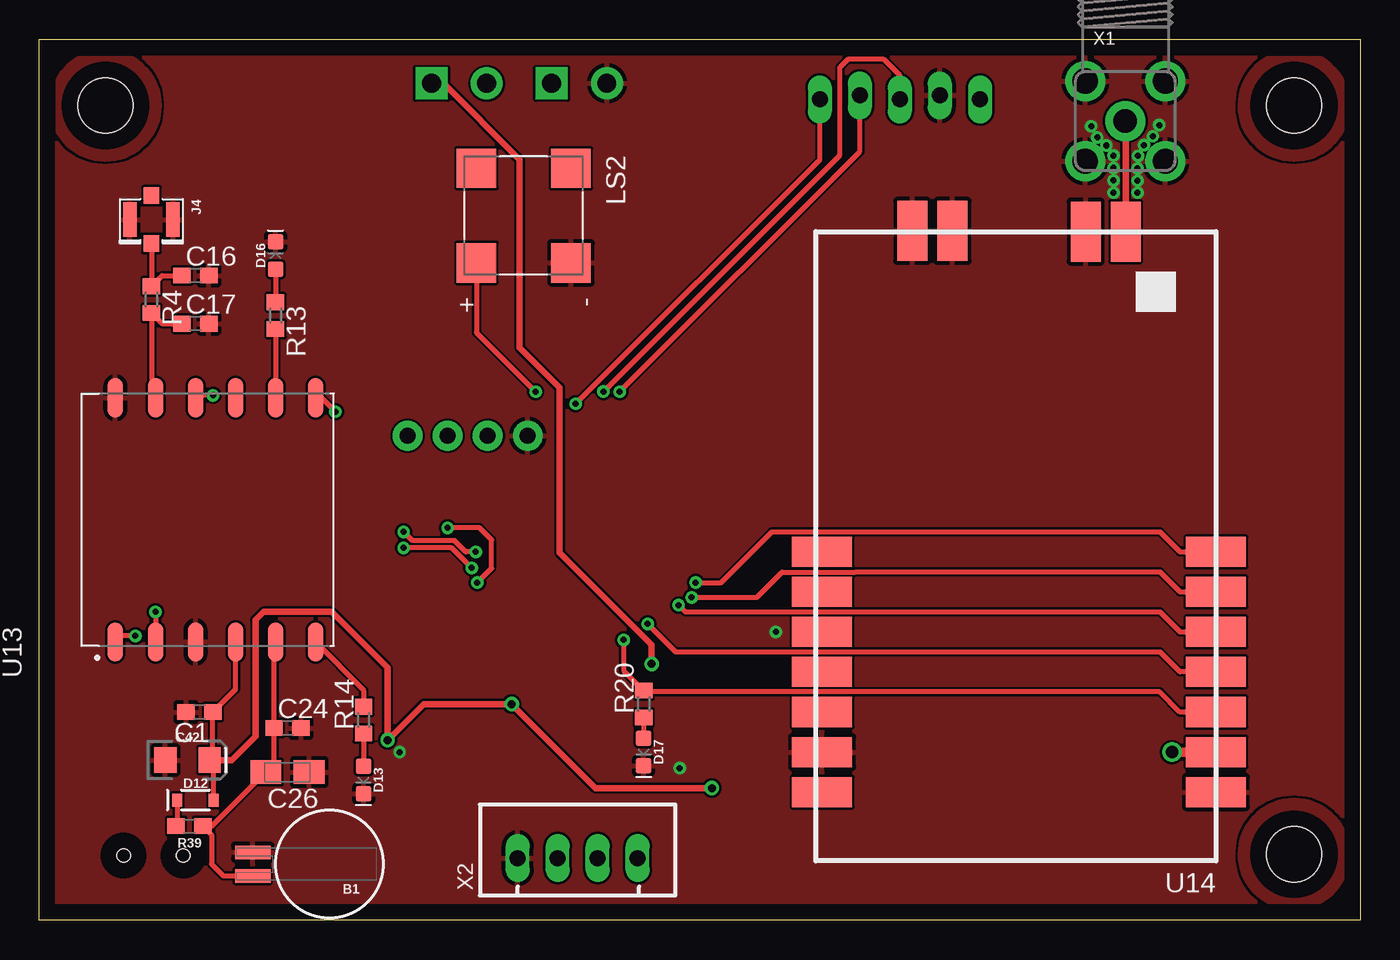
[diagram p5: board, top side]
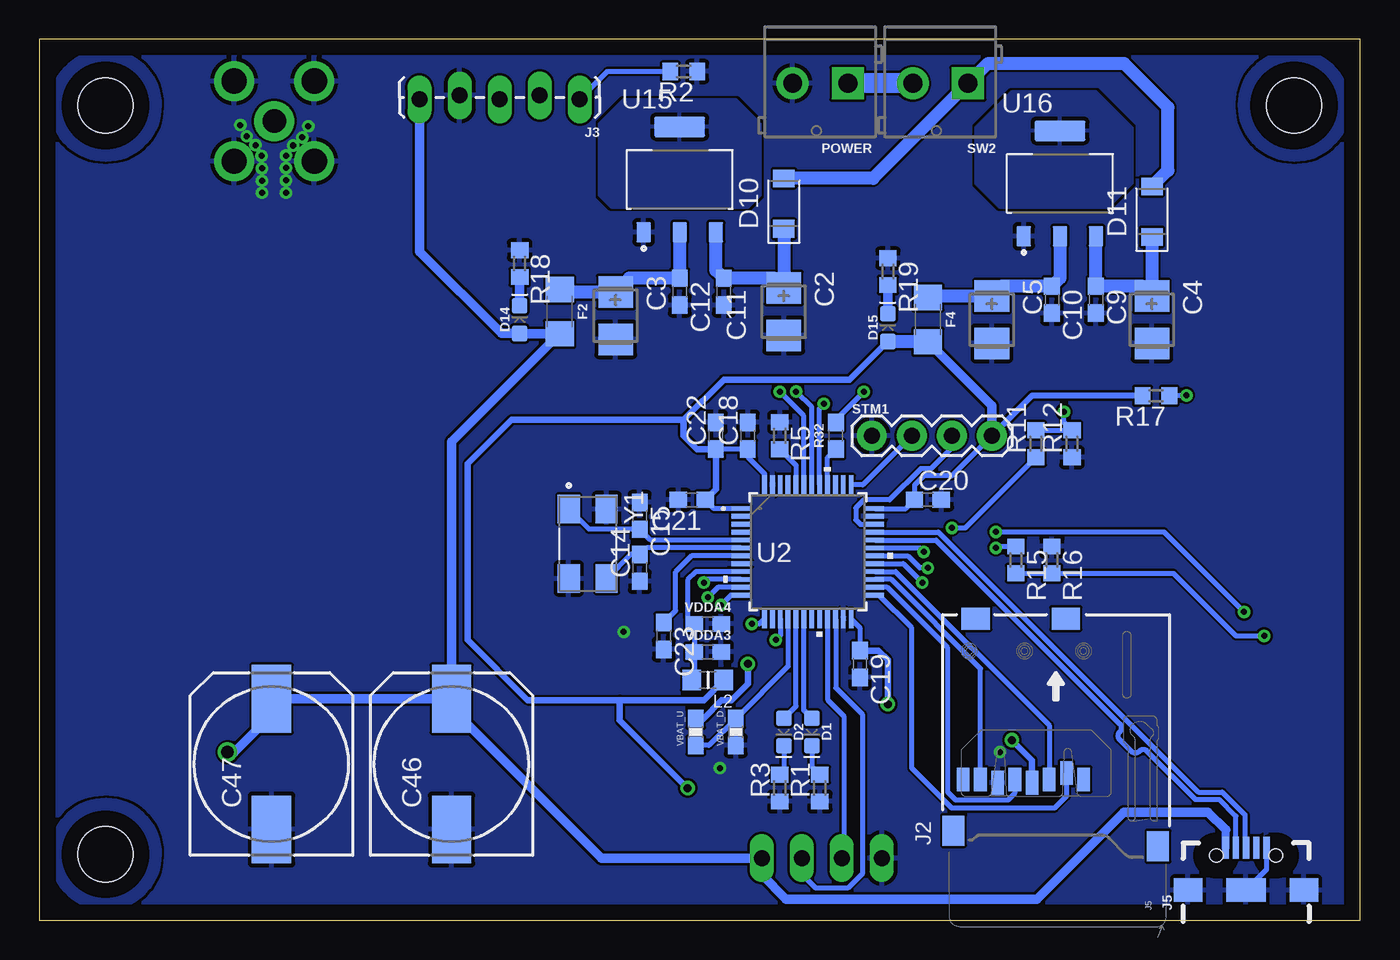
[diagram p6: board, bottom side, seen from below]

Size 83.82 x 55.88 mm. Coordinates in mm from the lower left corner, seen from the top.
Outline: 0,55.88 83.82,55.88 83.82,0 0,0 0,55.88
Copper layers (1*16): Top 0.035mm / dielectric 1.5mm / Bottom 0.035mm
Design rules "default": minimum track width 6mil, minimum drill 0.35mm, track to track 6mil, track to pad 6mil, pad to pad 6mil, via to via 6mil, smd to smd 6mil, copper to edge 40mil, drill to drill 6mil, minimum pad ring 10mil, minimum via ring 8mil, stop-mask expansion 4mil, vias tented up to drill 0mil, thermal gap 10mil
Holes 3.5 mm at 4.19,51.69 79.63,51.69 79.63,4.19

### Footprints (pad centres in the part's own frame; a part is rotated, then mirrored left to right if it is on the bottom)
BATTCON-6.8MM = smd 2.25 x 0.85: + 4.87,0.75; - 4.87,-0.75
C0603 = smd 1.1 x 1: 1 -0.85,0; 2 0.85,0
CT3528 = smd 2 x 2.2: + -1.5,0; - 1.5,0
A/3216-18R = smd 1.95 x 1.5: + 1.375,0; - -1.375,0
EIA3216 = smd 1.4 x 1.6: + 1.4,0; - -1.4,0
150CLZ-1010 = smd 4.3 x 2.5: + 4.15,0; - -4.15,0
LED-0603 = smd 1 x 1: A -0.877,0; C 0.877,0
SODFL3718X115 = smd 1.115 x 1.361: 1 -1.6,0; 2 1.6,0
SOD-323 = smd 0.63 x 0.83: A 1.15,0; C -1.15,0
1206 = smd 1.6 x 1.8: 1 -1.4,0; 2 1.4,0
CON-SD-CARD_2908-05 = smd 0.8 x 1.5: 1 1.761,3.847; 2 0.669,4.253; 3 -0.423,3.847; 4 -1.515,3.644; 5 -2.607,3.847; 6 -3.7,3.644; 7 -4.792,3.847; 8 -5.884,3.847 | smd 1.397 x 1.905: GND@1 -6.5,0.6; GND@2 6.473,-0.389 | smd 1.803 x 1.397: GND@3 0.631,14.059; GND@4 -5.084,14.059
1X05_LOCK_LONGPADS = drill 1.016 long: 1 0,0; 2 2.54,-0.254; 3 5.08,0; 4 7.62,-0.254; 5 10.16,0
U.FL = smd 2.2 x 0.85: 1 0,1.375; 2 0,-1.375 | smd 1.05 x 1: FEED 1.525,0; NC -1.525,0
USB-AB-MICRO-SMD = smd 1.4 x 0.4: D+1 2.7,0; D-1 2.7,0.65; GND1 2.7,-1.3; ID1 2.7,-0.65; VBUS1 2.7,1.3 | smd 1.5 x 1.8: SHLD1 0,-3.68; SHLD2 0,3.68 | smd 1.5 x 2.5: SHLD3 0,0 | hole 0.85: 2.2,1.9; 2.2,-1.9
RC-MASTER-SMD_L0805MP = smd 1.2 x 1.3: 1 -1.016,0; 2 1.016,0
CUI_CMT-7525S-SMT = smd 2.5 x 2.5: 1 -3,-3; 2 -3,3; N 3,3; P 3,-3
SCREWTERMINAL-3.5MM-2-NS = drill 1.2 pad 2.032 square: 1 0,0 | drill 1.2 pad 2.032: 2 3.5,0
R0603 = smd 1 x 1.1: 1 -0.85,0; 2 0.85,0
0603 = smd 1.1 x 1: 1 -0.85,0; 2 0.85,0
1X04 = drill 1.016 pad 1.88: 1 0,0; 2 2.54,0; 3 5.08,0; 4 7.62,0
LQFP48-7X7MM = smd 1.194 x 0.305: 1 -4.25,2.75; 2 -4.25,2.25; 3 -4.25,1.75; 4 -4.25,1.25; 5 -4.25,0.75; 6 -4.25,0.25; 7 -4.25,-0.25; 8 -4.25,-0.75; 9 -4.25,-1.25; 10 -4.25,-1.75; 11 -4.25,-2.25; 12 -4.25,-2.75; 25 4.25,-2.75; 26 4.25,-2.25; 27 4.25,-1.75; 28 4.25,-1.25; 29 4.25,-0.75; 30 4.25,-0.25; 31 4.25,0.25; 32 4.25,0.75; 33 4.25,1.25; 34 4.25,1.75; 35 4.25,2.25; 36 4.25,2.75 | smd 0.305 x 1.194: 13 -2.75,-4.25; 14 -2.25,-4.25; 15 -1.75,-4.25; 16 -1.25,-4.25; 17 -0.75,-4.25; 18 -0.25,-4.25; 19 0.25,-4.25; 20 0.75,-4.25; 21 1.25,-4.25; 22 1.75,-4.25; 23 2.25,-4.25; 24 2.75,-4.25; 37 2.75,4.25; 38 2.25,4.25; 39 1.75,4.25; 40 1.25,4.25; 41 0.75,4.25; 42 0.25,4.25; 43 -0.25,4.25; 44 -0.75,4.25; 45 -1.25,4.25; 46 -1.75,4.25; 47 -2.25,4.25; 48 -2.75,4.25
XCVR_L86 = smd 2.5 x 1: 1 -7.75,6.35; 2 -7.75,3.81; 3 -7.75,1.27; 4 -7.75,-1.27; 5 -7.75,-3.81; 6 -7.75,-6.35; 7 7.75,-6.35; 8 7.75,-3.81; 9 7.75,-1.27; 10 7.75,1.27; 11 7.75,3.81; 12 7.75,6.35
E32-868T30S = smd 3.81 x 1.905: 3V3 12.3,5.08; AUX -12.7,7.62; GND@0 -12.7,12.7; GND@1 12.3,10.16; M0 -12.7,-2.54; M1 -12.7,0; PB0 12.3,-2.54; PB1 12.3,0; PB3 12.3,2.54; RST 12.3,12.7; RX -12.7,2.54; SWIM 12.3,7.62; TX -12.7,5.08; VCC -12.7,10.16 | smd 1.905 x 3.81: ANT -6.97,-22.86; GND@2 6.57,-22.91; GND@3 4.03,-22.91; GND@4 -4.43,-22.86
SOT229P700X180-4N = smd 0.93 x 1.31: 1 -2.29,-3.345; 2 0,-3.345; 3 2.29,-3.345 | smd 3.24 x 1.31: 4 0,3.345
0603-RES = smd 1.1 x 1: 1 -0.85,0; 2 0.85,0
SMA90_DIP = drill 1.5 pad 2.54: ANTENNA 0,0 | drill 1.6 pad 2.54: GND1 -2.54,2.54; GND2 2.54,2.54; GND3 -2.54,-2.54; GND4 2.54,-2.54
JST-XH-04-PACKAGE-LONG-PAD = drill 1.016 long: 1 -3.81,0; 2 -1.27,0; 3 1.27,0; 4 3.81,0
XTAL_ABMM2-8.000MHZ-E2-T = smd 1.8 x 1.4: 1 -2.2,-1.2; 2 2.2,-1.2; 3 2.2,1.2; 4 -2.2,1.2

### Placement (x,y rotation side)
B1  18.41,3.56 180 top
C1  10.16,13.21 180 top
C2  36.58,38.61 270 bottom
C3  47.24,38.35 270 bottom
C4  13.21,38.1 270 bottom
C5  23.37,38.1 270 bottom
C9  16.76,39.37 270 bottom
C10  19.56,39.37 270 bottom
C11  40.39,39.88 270 bottom
C12  43.18,39.88 270 bottom
C14  45.72,22.35 90 bottom
C15  45.72,25.65 270 bottom
C16  9.91,40.89 0 top
C17  9.91,37.85 0 top
C18  38.86,30.73 90 bottom
C19  31.75,16.26 270 bottom
C20  27.43,26.67 0 bottom
C21  42.42,26.67 180 bottom
C22  40.89,30.73 90 bottom
C23  44.2,18.03 270 bottom
C24  15.75,12.19 0 top
C26  15.75,9.4 180 top
C42  9.4,10.16 0 top
C46  57.66,9.91 90 bottom
C47  69.09,9.91 90 bottom
D1  34.8,11.94 270 bottom
D2  36.58,11.94 270 bottom
D10  36.58,45.47 90 bottom
D11  13.21,44.96 90 bottom
D12  9.91,7.62 0 top
D13  20.57,8.89 270 top
D14  53.34,38.1 90 bottom
D15  29.97,37.59 90 bottom
D16  14.99,42.16 90 top
D17  38.35,10.67 270 top
F2  50.8,38.61 270 bottom
F4  27.43,38.1 270 bottom
J2  19.3,5.08 0 bottom
J3  49.53,52.07 180 bottom
J4  7.11,44.45 270 top
J5  7.24,1.9 90 bottom
L2  41.4,15.24 180 bottom
LS2  30.73,44.7 270 top
POWER  32.51,53.09 180 bottom
R1  34.29,8.38 90 bottom
R2  42.93,53.85 180 bottom
R3  36.83,8.38 90 bottom
R4  7.11,39.37 270 top
R5  36.83,30.73 270 bottom
R11  20.57,30.23 90 bottom
R12  18.29,30.23 90 bottom
R13  14.99,38.35 270 top
R14  20.57,12.7 90 top
R15  21.84,22.86 270 bottom
R16  19.56,22.86 270 bottom
R17  12.95,33.27 180 bottom
R18  53.34,41.66 270 bottom
R19  29.97,41.15 270 bottom
R20  38.35,13.72 90 top
R32  33.27,30.73 90 bottom
R39  9.52,5.97 180 top
STM1  30.99,30.73 0 bottom
SW2  24.89,53.09 180 bottom
U2  35.05,23.37 0 bottom
U13  11.18,25.4 90 top
U14  61.98,20.83 180 top
U15  43.18,46.99 0 bottom
U16  19.05,46.74 0 bottom
VBAT_D  39.62,11.94 90 bottom
VBAT_U  42.16,11.94 90 bottom
VDDA3  41.4,17.02 0 bottom
VDDA4  41.4,18.8 0 bottom
X1  68.91,50.7 0 top
X2  34.16,3.94 0 top
Y1  49.02,23.88 270 bottom

### Tracks (layer width: path | path; a pad name or v marks a point on that pad's centre or on a via)
3.3V  (via drill 0.51)
  Top 0.305: U13.4 12.45,14.64 C1.1 11.01,10.37 C42.+ 11.06,9.9 D12.A
  Top 0.406: v42.67,8.38 35.31,8.38 v29.97,13.72 24.38,13.72 v22.1,11.43 22.1,16 18.54,19.56 14.22,19.56 13.72,19.05 13.72,11.68 12.19,10.16 C42.+
  Bottom 0.305: U2.36 28.83,26.12 C20.1 28.28,27.6 27.69,28.19 25.91,28.19 STM1.4 | U2.48 37.8,28.32 38.86,29.38 C18.1 C22.1 | U2.1 41.02,26.12 C21.1 | U2.24 31.75,18.57 C19.1
  Bottom 0.381: R17.2 20.83,33.27 STM1.4
  Bottom 0.406: D15.A 32.4,34.29 40.39,34.29 42.93,31.75 | 42.93,31.75 42.93,30.73 42.08,29.88 C22.1 40.89,27.34 C21.1 | 42.93,31.75 53.85,31.75 56.64,28.96 56.64,17.78 52.83,13.97 46.99,13.97 | 46.99,13.97 41.66,13.97 L2.1 | 46.99,13.97 46.99,12.7 v42.67,8.38 | v29.97,13.72 29.97,16.51 30.57,17.11 C19.1 | v22.1,11.43 20.82,10.15 J2.4
  Bottom 0.61: STM1.4 23.37,32.64 F4.2
  Bottom 0.813: F4.2 29.96,36.7 D15.A
5V  (via drill 0.81)
  Top 0.61: U14.VCC v71.88,10.67
  Bottom 0.508: J5.VBUS1 8.54,5.75
  Bottom 0.61: C46.+ 57.66,30.35 F2.2 53.32,37.21 D14.A 54.49,37.22 59.69,42.42 J3.5 | C46.+ C47.+ 69.09,13.04 71.46,10.67 v71.88,10.67 | 8.54,5.75 9.65,6.86 14.99,6.86 20.52,1.32 36.42,1.32 37.97,2.87 X2.4 48.13,3.94 57.66,13.46 C46.+
AUX  (via drill 0.38)
  Top 0.305: v37.08,17.78 37.08,15.84 R20.2 38.43,14.49 71.11,14.49 72.39,13.21 U14.AUX
  Bottom 0.305: U2.15 36.8,18.06 v37.08,17.78
BT0
  Bottom 0.305: R5.2 35.8,28.86 U2.44
BZZR
  Bottom 0.305: U2.40 33.8,29.36 R32.1
CS
  Bottom 0.305: J2.2 18.63,7.87 19.4,7.11 25.91,7.11 28.45,9.65 28.45,18.54 30.52,20.62 U2.25
D1
  pour Top: 83.13,51.69 arc-90 79.6,48.18 arc-90 76.12,51.71 arc-90 79.63,55.19 arc-90
  pour Bottom: 76.12,51.66 arc90 79.6,48.18 arc90 83.13,51.71 arc90 79.58,55.19 arc90
D2
  pour Top: 7.7,51.69 arc-90 4.17,48.18 arc-90 0.69,51.71 arc-90 4.19,55.19 arc-90
  pour Bottom: 0.69,51.66 arc90 4.17,48.18 arc90 7.7,51.71 arc90 4.14,55.19 arc90
D3
  pour Top: 83.13,4.19 arc-90 79.6,0.69 arc-90 76.12,4.22 arc-90 79.63,7.7 arc-90
  pour Bottom: 76.12,4.17 arc90 79.6,0.69 arc90 83.13,4.22 arc90 79.58,7.7 arc90
DRDY  (via drill 0.38)
  Top 0.305: J3.1 49.53,48.26 v34.04,32.77
  Bottom 0.305: J3.1 47.75,53.85 R2.2 | U2.41 34.3,32.5 v34.04,32.77
FN  (via drill 0.38)
  Top 0.305: v27.79,21.41 28.7,22.32 28.7,24.13 27.94,24.89 v25.91,24.89
  Bottom 0.305: U2.29 29,22.62 v27.79,21.41 | v25.91,24.89 25.06,24.89 R11.1
GND  (via drill 0.38)
  Bottom 0.305: J5.GND1 5.94,3.21 J5.SHLD3
  other vias: 46.74,18.29 40.64,9.65 22.86,10.67 68.17,46.15 68.17,46.94 68.17,47.73 68.17,48.51 67.72,49.15 69.7,46.15 69.7,46.91 69.7,47.7 69.72,48.49 70.1,49.17 70.66,49.73 67.13,49.66 66.75,50.37 71.07,50.44
  pour Bottom (rank 2): -0.51,-0.51 -0.51,56.39 84.33,56.39 84.33,-0.51
  pour Top (rank 2): -1.02,-1.02 -1.02,56.9 84.84,56.9 84.84,-1.02
HT
  pour Bottom: 38.86,45.21 47.5,45.21 48.26,45.97 48.26,50.55 46.74,52.07 39.62,52.07 38.1,50.55 38.1,45.97
HT2
  pour Bottom: 16,45.21 22.86,45.21 24.38,46.74 24.38,50.29 22.1,52.58 16.76,52.58 14.48,50.29 14.48,46.74
LED
  Bottom 0.305: U2.18 35.3,13.32 D1.A
LED2
  Bottom 0.305: U2.17 35.8,13.59 D2.A
M0  (via drill 0.38)
  Top 0.305: v41.66,21.42 43.26,21.42 46.48,24.64 71.12,24.64 72.39,23.37 U14.M0
  Bottom 0.305: U2.10 41.46,21.62 v41.66,21.42
M1  (via drill 0.38)
  Top 0.305: v41.4,20.48 45.53,20.48 47.14,22.09 51.8,22.09 51.82,22.1 71.12,22.1 72.39,20.83 U14.M1
  Bottom 0.305: U2.11 40.76,21.12 v41.4,20.48
MISO
  Bottom 0.305: J2.7 24.1,15.97 29.75,21.62 U2.27
MOSI
  Bottom 0.305: U2.28 29.48,22.12 19.73,12.36 J2.3
N$1
  Bottom 0.305: D1.C 34.8,9.74 R1.2
N$2
  Top 0.305: D16.A R13.1
N$3
  Bottom 0.305: D2.C 36.58,9.49 R3.2
N$4  (via drill 0.38)
  Top 0.305: v31.5,33.53 27.74,37.28 27.74,41.7 LS2.P
  Bottom 0.305: R32.2 33.27,31.75 v31.5,33.53
N$22
  Bottom 0.813: D10.1 C2.+ 37.2,40.73 C11.1 40.89,41.23 U15.3
N$23
  Bottom 0.813: U15.2 C12.1 46.37,40.73 C3.+ 50.65,39.85 F2.1
N$24
  Bottom 0.813: D11.1 C4.+ 13.83,40.22 C9.1 U16.3
N$25
  Bottom 0.813: U16.2 19.05,40.73 C10.1 22.75,40.22 C5.+ 27.33,39.6 F4.1
N$27
  Top 0.406: X1.ANTENNA 68.95,50.66 U14.ANT
N$30
  Bottom 1.27: SW2.2 POWER.1
N$31
  Top 0.305: D12.C 8.76,6.05 R39.2
N$32  (via drill 0.38)
  Top 0.305: v11.02,33.3 10.05,33.3 U13.10
  Bottom 0.305: R17.1 12.08,33.3 v11.02,33.3
N$33
  Top 0.305: U13.6 20.57,14.6 R14.2
N$34
  Top 0.305: R14.1 D13.A
N$35
  Bottom 0.61: D14.C R18.2
N$36
  Bottom 0.61: D15.C R19.2
N$37
  Top 0.305: R13.2 U13.8
N$39
  Top 0.305: J4.FEED R4.1 7.79,40.89 C16.1
N$40  (via drill 0.38)
  Top 0.305: v18.8,32.26 17.9,33.15 U13.7
  Bottom 0.305: v18.8,32.26 18.8,31.58 R12.2 R11.2
N$41
  Top 0.305: R20.1 D17.A
NRST
  Bottom 0.305: U2.7 42.42,23.11 43.43,22.1 43.43,19.65 C23.1
OSC_IN
  Bottom 0.305: Y1.1 48.95,24.8 C15.2 45.03,24.12 U2.5
OSC_OUT
  Bottom 0.305: Y1.3 46.3,23.2 C14.2 45.3,23.62 U2.6
RX1  (via drill 0.38)
  Top 0.305: v7.37,19.56 U13.2 | v27.69,23.37 27.06,23.37 26.35,24.08 23.67,24.08 v23.11,24.64
  Bottom 0.305: U2.31 27.94,23.62 v27.69,23.37 | v23.11,24.64 12.45,24.64 v7.37,19.56
RX2  (via drill 0.38)
  Top 0.305: v38.61,18.8 40.39,17.02 71.12,17.02 72.39,15.75 U14.TX
  Bottom 0.305: U2.13 38.12,18.8 v38.61,18.8
RX3
  Bottom 0.305: U2.22 33.27,19.09 33.27,14.73 31.6,13.06 31.6,2.95 32.51,2.03 34.54,2.03 35.56,3.05 35.56,3.81 X2.3
SCK
  Bottom 0.305: J2.5 21.91,8.06 22.35,7.62 25.65,7.62 26.16,8.13 26.16,17.27 30.01,21.12 U2.26
SCL  (via drill 0.38)
  Top 0.305: v35.8,33.54 50.8,48.54 50.8,54.1 51.31,54.61 53.59,54.61 54.61,53.59 J3.3
  Bottom 0.305: U2.42 34.8,32.54 v35.8,33.54
SDA  (via drill 0.38)
  Top 0.305: v36.83,33.53 52.07,48.77 J3.2
  Bottom 0.305: U2.43 35.3,32 v36.83,33.53
SWCLK
  Bottom 0.305: STM1.2 31.56,27.62 U2.37
SWDIO
  Bottom 0.305: STM1.3 25.91,29.97 27.23,28.65 27.88,28.65 29.86,26.67 31.5,26.67 32,26.16 32,25.4 31.72,25.12 U2.34
TX1  (via drill 0.38)
  Top 0.305: v27.43,22.35 26.16,23.62 v23.11,23.62
  Bottom 0.305: U2.30 28.71,23.12 27.94,22.35 v27.43,22.35 | v23.11,23.62 23.03,23.71 R15.1
TX2  (via drill 0.38)
  Top 0.305: v40.56,19.99 40.99,19.56 71.12,19.56 72.39,18.29 U14.RX
  Bottom 0.305: U2.12 39.94,20.62 v40.56,19.99
TX3
  Bottom 0.305: U2.21 33.8,13.99 32.77,12.95 32.77,4.06 X2.2
TXD  (via drill 0.38)
  Top 0.305: v6.1,18.03 5.21,18.03 U13.1
  Bottom 0.305: R15.2 R16.2 11.85,22.01 7.87,18.03 v6.1,18.03
USB_N
  Bottom 0.305: U2.32 26.91,24.12 15.24,12.45 arc90 15.24,11.96 15.26,11.94 arc-90 15.26,11.46 14.51,10.71 arc-90 14.03,10.71 14.01,10.73 arc90 13.52,10.73 10.46,7.67 8.94,7.67 7.87,6.6 7.87,4.62 J5.D-1
USB_P
  Bottom 0.305: U2.33 26.77,24.62 10.27,8.13 8.75,8.13 7.29,6.67 7.29,4.66 J5.D+1
V_BCKP
  Top 0.305: B1.+ 11.67,2.81 10.92,3.56 10.92,5.42 R39.1 10.94,5.97 C26.+ 14.9,9.92 C24.1 14.9,17.56 U13.5
VB
  Bottom 0.305: U2.16 36.3,16.11 VBAT_D.2 41.32,11.09 VBAT_U.1
VCC  (via drill 0.51)
  Top 0.406: SW2.1 25.65,53.09 30.48,48.26 30.48,36.32 33.02,33.78 33.02,23.32 38.86,17.48 v38.86,16.26
  Bottom 0.406: v38.86,16.26 38.86,14.99 39.9,13.95 40.52,13.95 41.69,12.79 VBAT_U.2
  Bottom 0.813: D10.2 30.91,47.07 SW2.1 23.62,54.36 14.99,54.36 12.19,51.56 12.19,47.57 D11.2
VDDA
  Bottom 0.305: U2.9 42.14,22.12 42.67,21.59 42.67,19.22 VDDA4.1 VDDA3.1 42.25,15.41 L2.2
XANT
  Top 0.305: U13.11 7.11,33.4 R4.2 7.79,37.85 C17.1